# EAGLE schematic piboard (EAGLE 9.6.2)

## Sheet 1 of 5
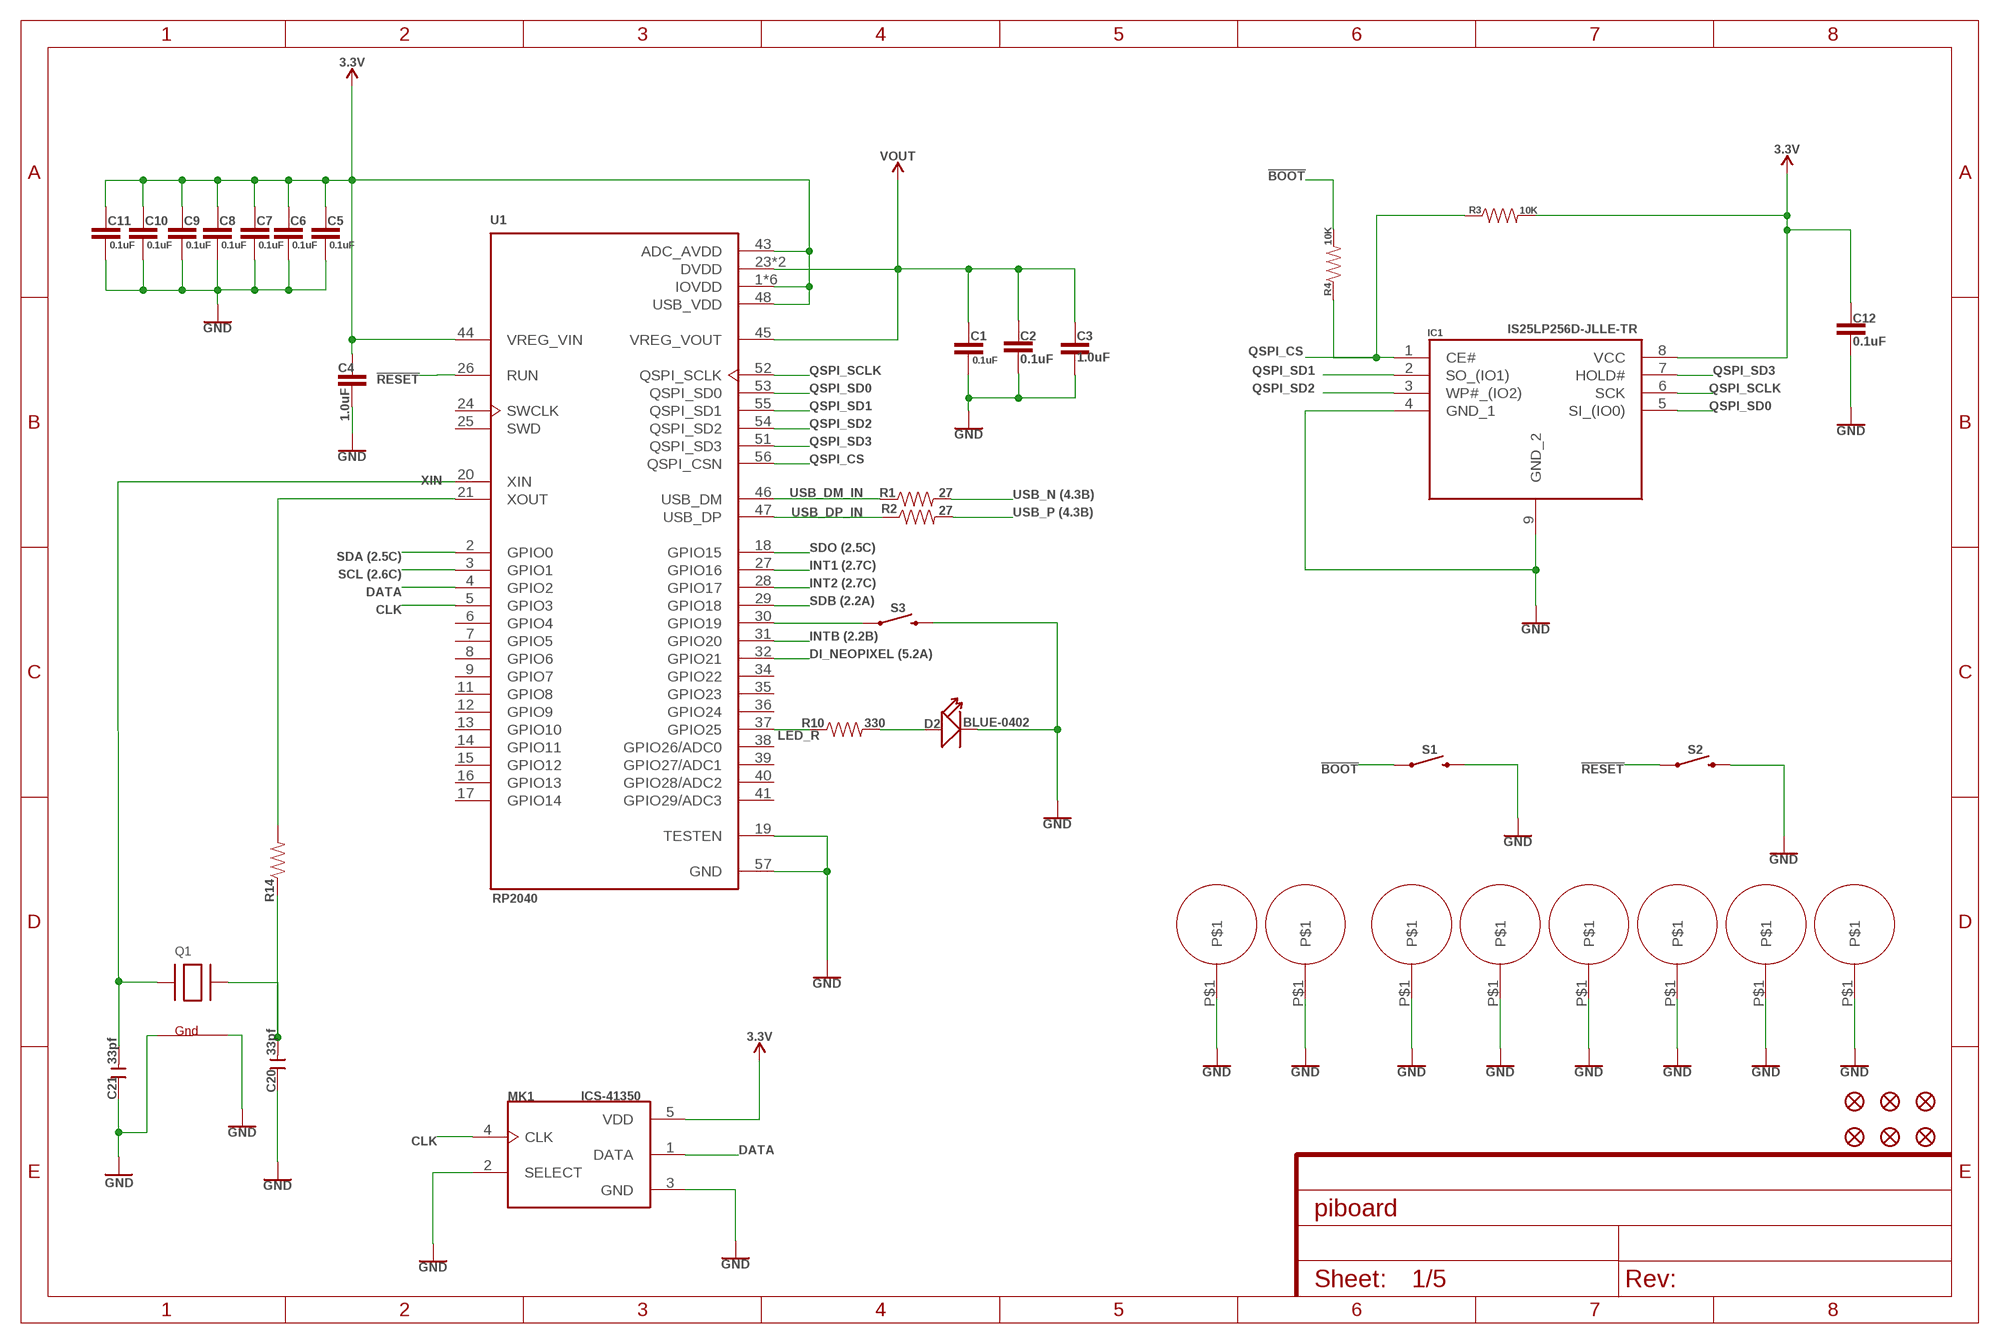
[diagram p0: schematic, sheet 1]

### Parts
C1  0.1uF  0.1UF-0402-16V-10%  [0402]
C2  0.1uF  0.1UF-0402-16V-10%  [0402]
C3  1.0uF  1.0UF-0402-16V-10%  [0402]
C4  1.0uF  1.0UF-0402-16V-10%  [0402]
C5  0.1uF  0.1UF-0402-16V-10%  [0402]
C6  0.1uF  0.1UF-0402-16V-10%  [0402]
C7  0.1uF  0.1UF-0402-16V-10%  [0402]
C8  0.1uF  0.1UF-0402-16V-10%  [0402]
C9  0.1uF  0.1UF-0402-16V-10%  [0402]
C10  0.1uF  0.1UF-0402-16V-10%  [0402]
C11  0.1uF  0.1UF-0402-16V-10%  [0402]
C12  0.1uF  0.1UF-0402-16V-10%  [0402]
C20  33pf  CERAMIC-33PF-50V-5%-NPO(0402)  [C0402]
C21  33pf  CERAMIC-33PF-50V-5%-NPO(0402)  [C0402]
D2  BLUE-0402  SMD-LED-CLEAR-BLUE(0402)  [LED-0402]
FD1  FIDUCIAL1X2  [FIDUCIAL-1X2]
FD2  FIDUCIAL1X2  [FIDUCIAL-1X2]
FD3  FIDUCIAL1X2  [FIDUCIAL-1X2]
FD4  FIDUCIAL1X2  [FIDUCIAL-1X2]
FD5  FIDUCIAL1X2  [FIDUCIAL-1X2]
FD6  FIDUCIAL1X2  [FIDUCIAL-1X2]
H1  M25  [M25]
H2  M25  [M25]
H3  M25  [M25]
H4  M25  [M25]
H5  M25  [M25]
H6  M25  [M25]
H7  M25  [M25]
H8  M25  [M25]
IC1  IS25LP256D-JLLE-TR  [SON127P800X600X80-9N]
MK1  ICS-41350  [MIC_ICS-41350]
Q1  XTAL-4-3225  [NX3225]
R1  27  RESISTOR0402  [0402]
R2  27  RESISTOR0402  [0402]
R3  10K  RESISTOR0402  [0402]
R4  10K  RESISTOR0402  [0402]
R10  330  RESISTOR0402  [0402]
R14  RESISTOR0402  [0402]
S1  MOMENTARY-SWITCH-SPST-SMD-4.6X2.8MM  [TACTILE_SWITCH_SMD_4.6X2.8MM]
S2  MOMENTARY-SWITCH-SPST-SMD-4.6X2.8MM  [TACTILE_SWITCH_SMD_4.6X2.8MM]
S3  MOMENTARY-SWITCH-SPST-SMD-4.6X2.8MM  [TACTILE_SWITCH_SMD_4.6X2.8MM]
U1  RP2040  [QFN40P700X700X90-57N]

### Nets
3.3V: C4.1 C5.1 C6.1 C7.1 C8.1 C9.1 C10.1 C11.1 C12.1 IC1.8(VCC) MK1.5(VDD) R3.2 U1.1(IOVDD) U1.10(IOVDD) U1.22(IOVDD) U1.33(IOVDD) U1.42(IOVDD) U1.43(ADC_AVDD) U1.44(VREG_VIN) U1.48(USB_VDD) U1.49(IOVDD) ; also sheet 2,4,5
!BOOT: R4.2 S1.1 S1.2
!RESET: S2.1 S2.2 U1.26(RUN)
CLK: MK1.4(CLK) U1.5(GPIO3)
DATA: MK1.1(DATA) U1.4(GPIO2)
DI_NEOPIXEL: U1.32(GPIO21) ; also sheet 5
GND: C1.2 C2.2 C3.2 C4.2 C5.2 C6.2 C7.2 C8.2 C9.2 C10.2 C11.2 C12.2 C20.1 C21.1 D2.- H1.P$1 H2.P$1 H3.P$1 H4.P$1 H5.P$1 H6.P$1 H7.P$1 H8.P$1 IC1.4(GND_1) IC1.9(GND_2) MK1.2(SELECT) MK1.3(GND) Q1.2(G2) Q1.4(G1) S1.3 S1.4 S2.3 S2.4 S3.3 S3.4 U1.19(TESTEN) U1.57(GND) ; also sheet 2,4,5
INT1: U1.27(GPIO16) ; also sheet 2
INT2: U1.28(GPIO17) ; also sheet 2
INTB: U1.31(GPIO20) ; also sheet 2
LED_R: R10.1 U1.37(GPIO25)
N$1: D2.+ R10.2
N$4: C20.2 Q1.3(X2) R14.1
N$6: R14.2 U1.21(XOUT)
N$9: S3.1 S3.2 U1.30(GPIO19)
QSPI_CS: IC1.1(CE#) R3.1 R4.1 U1.56(QSPI_CSN)
QSPI_SCLK: IC1.6(SCK) U1.52(QSPI_SCLK)
QSPI_SD0: IC1.5(SI_(IO0)) U1.53(QSPI_SD0)
QSPI_SD1: IC1.2(SO_(IO1)) U1.55(QSPI_SD1)
QSPI_SD2: IC1.3(WP#_(IO2)) U1.54(QSPI_SD2)
QSPI_SD3: IC1.7(HOLD#) U1.51(QSPI_SD3)
SCL: U1.3(GPIO1) ; also sheet 2
SDA: U1.2(GPIO0) ; also sheet 2
SDB: U1.29(GPIO18) ; also sheet 2
SDO: U1.18(GPIO15) ; also sheet 2
USB_DM_IN [USB]: R1.1 U1.46(USB_DM)
USB_DP_IN [USB]: R2.1 U1.47(USB_DP)
USB_N [USB]: R1.2 ; also sheet 4
USB_P [USB]: R2.2 ; also sheet 4
VOUT: C1.1 C2.1 C3.1 U1.23(DVDD) U1.45(VREG_VOUT) U1.50(DVDD)
XIN: C21.2 Q1.1(X1) U1.20(XIN)
Unconnected: U1.6(GPIO4) U1.7(GPIO5) U1.8(GPIO6) U1.9(GPIO7) U1.11(GPIO8) U1.12(GPIO9) U1.13(GPIO10) U1.14(GPIO11) U1.15(GPIO12) U1.16(GPIO13) U1.17(GPIO14) U1.24(SWCLK) U1.25(SWD) U1.34(GPIO22) U1.35(GPIO23) U1.36(GPIO24) U1.38(GPIO26/ADC0) U1.39(GPIO27/ADC1) U1.40(GPIO28/ADC2) U1.41(GPIO29/ADC3)

## Sheet 2 of 5
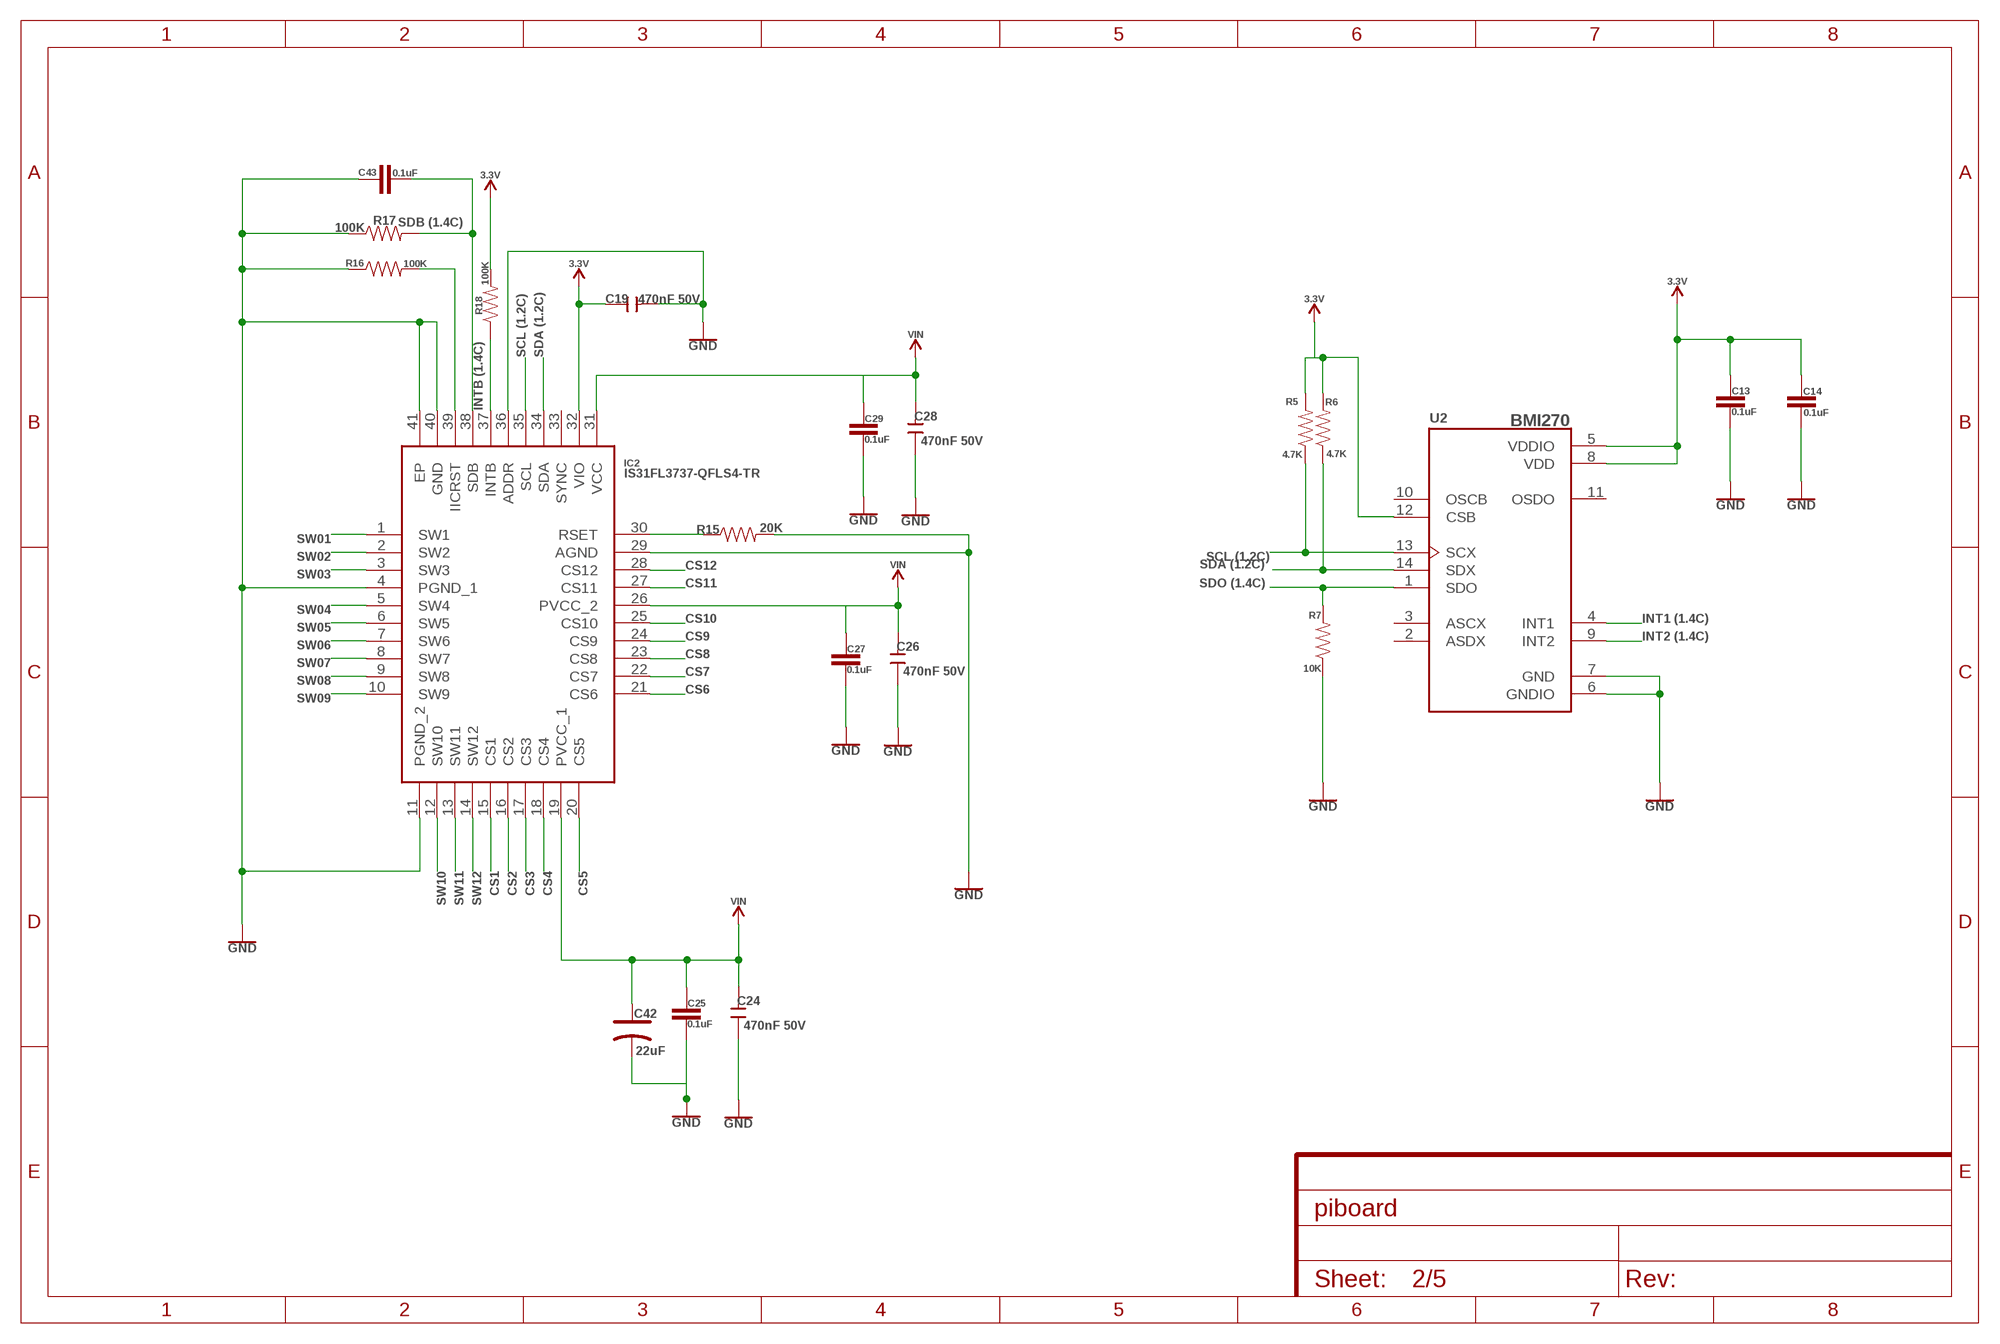
[diagram p1: schematic, sheet 2]

### Parts
C13  0.1uF  0.1UF-0402-16V-10%  [0402]
C14  0.1uF  0.1UF-0402-16V-10%  [0402]
C19  470nF 50V  CERAMIC-390PF-50V-10%-X7R(0402)  [C0402]
C24  470nF 50V  CERAMIC-390PF-50V-10%-X7R(0402)  [C0402]
C25  0.1uF  0.1UF-0402-16V-10%  [0402]
C26  470nF 50V  CERAMIC-390PF-50V-10%-X7R(0402)  [C0402]
C27  0.1uF  0.1UF-0402-16V-10%  [0402]
C28  470nF 50V  CERAMIC-390PF-50V-10%-X7R(0402)  [C0402]
C29  0.1uF  0.1UF-0402-16V-10%  [0402]
C42  22uF  TANTALUM-SMD-22UF-10V(AVX-A)  [AVX-A]
C43  0.1uF  0.1UF-0402-16V-10%  [0402]
IC2  IS31FL3737-QFLS4-TR  [QFN40P500X500X80-41N]
R5  4.7K  RESISTOR0402  [0402]
R6  4.7K  RESISTOR0402  [0402]
R7  10K  RESISTOR0402  [0402]
R15  20K  RESISTOR0402  [0402]
R16  100K  100KOHM-0402-1/16W-1%  [0402]
R17  100K  100KOHM-0402-1/16W-1%  [0402]
R18  100K  100KOHM-0402-1/16W-1%  [0402]
U2  BMI270  [XDCR_BMI270]

### Nets
3.3V: C13.1 C14.1 C19.1 IC2.32(VIO) R5.2 R6.2 R18.2 U2.5(VDDIO) U2.8(VDD) U2.12(CSB) ; also sheet 1,4,5
CS1: IC2.15(CS1) ; also sheet 3
CS2: IC2.16(CS2) ; also sheet 3
CS3: IC2.17(CS3) ; also sheet 3
CS4: IC2.18(CS4) ; also sheet 3
CS5: IC2.20(CS5) ; also sheet 3
CS6: IC2.21(CS6) ; also sheet 3
CS7: IC2.22(CS7) ; also sheet 3
CS8: IC2.23(CS8) ; also sheet 3
CS9: IC2.24(CS9) ; also sheet 3
CS10: IC2.25(CS10) ; also sheet 3
CS11: IC2.27(CS11) ; also sheet 3
CS12: IC2.28(CS12) ; also sheet 3
GND: C13.2 C14.2 C19.2 C24.1 C25.2 C26.1 C27.2 C28.1 C29.2 C42.- C43.1 IC2.4(PGND_1) IC2.11(PGND_2) IC2.29(AGND) IC2.36(ADDR) IC2.40(GND) IC2.41(EP) R7.1 R15.2 R16.1 R17.1 U2.6(GNDIO) U2.7(GND) ; also sheet 1,4,5
INT1: U2.4(INT1) ; also sheet 1
INT2: U2.9(INT2) ; also sheet 1
INTB: IC2.37(INTB) R18.1 ; also sheet 1
N$10: IC2.30(RSET) R15.1
N$18: IC2.39(IICRST) R16.2
SCL: IC2.35(SCL) R5.1 U2.13(SCX) ; also sheet 1
SDA: IC2.34(SDA) R6.1 U2.14(SDX) ; also sheet 1
SDB: C43.2 IC2.38(SDB) R17.2 ; also sheet 1
SDO: R7.2 U2.1(SDO) ; also sheet 1
SW01: IC2.1(SW1) ; also sheet 3
SW02: IC2.2(SW2) ; also sheet 3
SW03: IC2.3(SW3) ; also sheet 3
SW04: IC2.5(SW4) ; also sheet 3
SW05: IC2.6(SW5) ; also sheet 3
SW06: IC2.7(SW6) ; also sheet 3
SW07: IC2.8(SW7) ; also sheet 3
SW08: IC2.9(SW8) ; also sheet 3
SW09: IC2.10(SW9) ; also sheet 3
SW10: IC2.12(SW10) ; also sheet 3
SW11: IC2.13(SW11) ; also sheet 3
SW12: IC2.14(SW12) ; also sheet 3
VIN: C24.2 C25.1 C26.2 C27.1 C28.2 C29.1 C42.+ IC2.19(PVCC_1) IC2.26(PVCC_2) IC2.31(VCC) ; also sheet 4
Unconnected: IC2.33(SYNC) U2.2(ASDX) U2.3(ASCX) U2.10(OSCB) U2.11(OSDO)

## Sheet 3 of 5
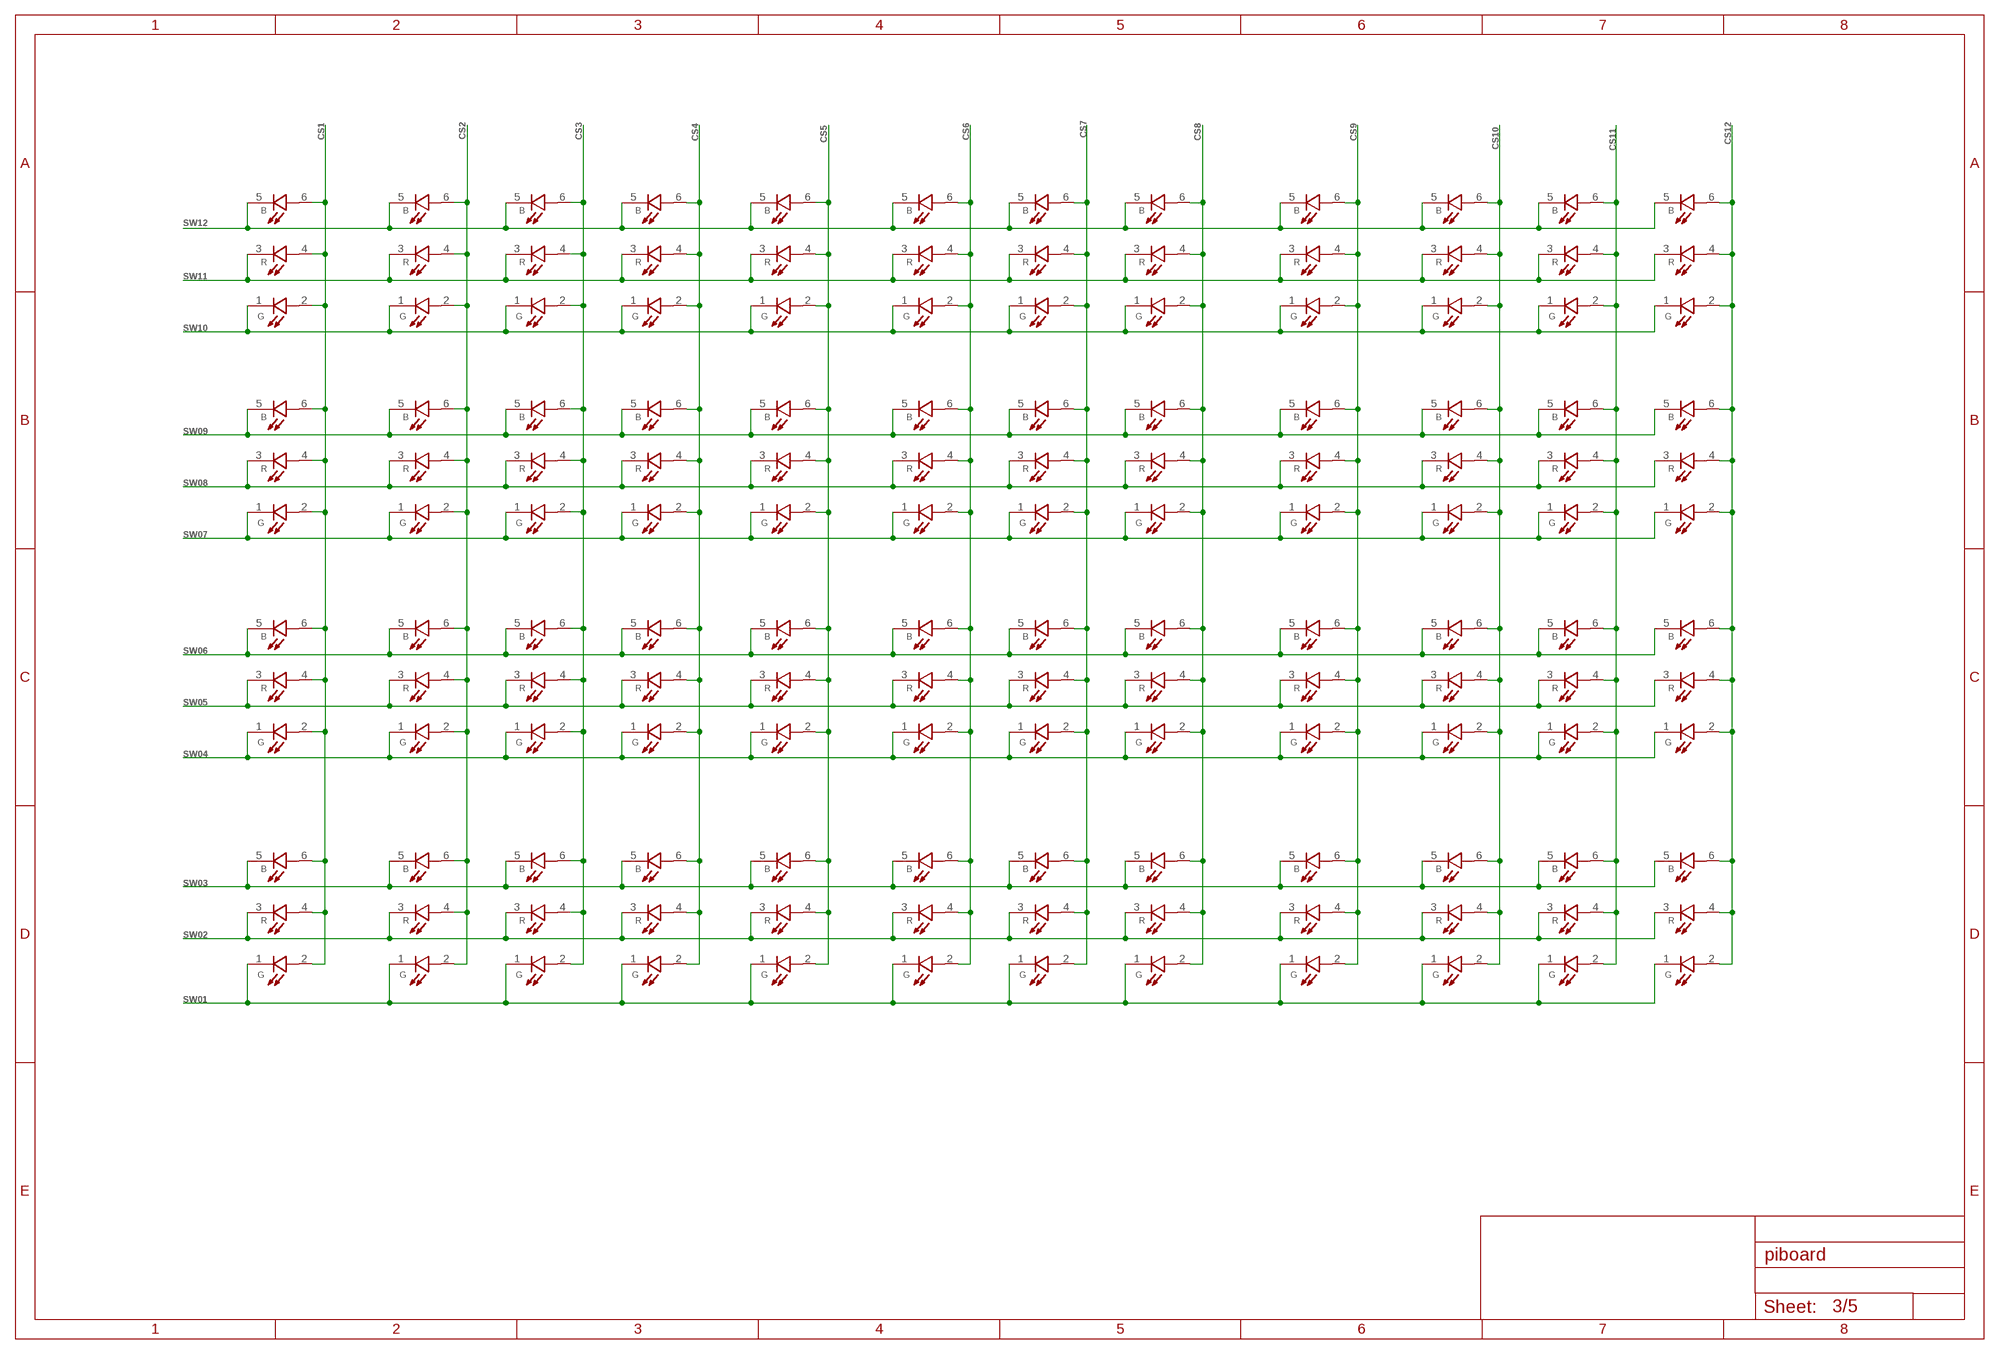
[diagram p2: schematic, sheet 3]

### Parts
RGB1  19-337C/RSBHGHC-A88/4T  [LED_19-337C/RSBHGHC-A88/4T]
RGB2  19-337C/RSBHGHC-A88/4T  [LED_19-337C/RSBHGHC-A88/4T]
RGB3  19-337C/RSBHGHC-A88/4T  [LED_19-337C/RSBHGHC-A88/4T]
RGB4  19-337C/RSBHGHC-A88/4T  [LED_19-337C/RSBHGHC-A88/4T]
RGB5  19-337C/RSBHGHC-A88/4T  [LED_19-337C/RSBHGHC-A88/4T]
RGB6  19-337C/RSBHGHC-A88/4T  [LED_19-337C/RSBHGHC-A88/4T]
RGB7  19-337C/RSBHGHC-A88/4T  [LED_19-337C/RSBHGHC-A88/4T]
RGB8  19-337C/RSBHGHC-A88/4T  [LED_19-337C/RSBHGHC-A88/4T]
RGB9  19-337C/RSBHGHC-A88/4T  [LED_19-337C/RSBHGHC-A88/4T]
RGB10  19-337C/RSBHGHC-A88/4T  [LED_19-337C/RSBHGHC-A88/4T]
RGB11  19-337C/RSBHGHC-A88/4T  [LED_19-337C/RSBHGHC-A88/4T]
RGB12  19-337C/RSBHGHC-A88/4T  [LED_19-337C/RSBHGHC-A88/4T]
RGB13  19-337C/RSBHGHC-A88/4T  [LED_19-337C/RSBHGHC-A88/4T]
RGB14  19-337C/RSBHGHC-A88/4T  [LED_19-337C/RSBHGHC-A88/4T]
RGB15  19-337C/RSBHGHC-A88/4T  [LED_19-337C/RSBHGHC-A88/4T]
RGB16  19-337C/RSBHGHC-A88/4T  [LED_19-337C/RSBHGHC-A88/4T]
RGB17  19-337C/RSBHGHC-A88/4T  [LED_19-337C/RSBHGHC-A88/4T]
RGB18  19-337C/RSBHGHC-A88/4T  [LED_19-337C/RSBHGHC-A88/4T]
RGB19  19-337C/RSBHGHC-A88/4T  [LED_19-337C/RSBHGHC-A88/4T]
RGB20  19-337C/RSBHGHC-A88/4T  [LED_19-337C/RSBHGHC-A88/4T]
RGB21  19-337C/RSBHGHC-A88/4T  [LED_19-337C/RSBHGHC-A88/4T]
RGB22  19-337C/RSBHGHC-A88/4T  [LED_19-337C/RSBHGHC-A88/4T]
RGB23  19-337C/RSBHGHC-A88/4T  [LED_19-337C/RSBHGHC-A88/4T]
RGB24  19-337C/RSBHGHC-A88/4T  [LED_19-337C/RSBHGHC-A88/4T]
RGB25  19-337C/RSBHGHC-A88/4T  [LED_19-337C/RSBHGHC-A88/4T]
RGB26  19-337C/RSBHGHC-A88/4T  [LED_19-337C/RSBHGHC-A88/4T]
RGB27  19-337C/RSBHGHC-A88/4T  [LED_19-337C/RSBHGHC-A88/4T]
RGB28  19-337C/RSBHGHC-A88/4T  [LED_19-337C/RSBHGHC-A88/4T]
RGB29  19-337C/RSBHGHC-A88/4T  [LED_19-337C/RSBHGHC-A88/4T]
RGB30  19-337C/RSBHGHC-A88/4T  [LED_19-337C/RSBHGHC-A88/4T]
RGB31  19-337C/RSBHGHC-A88/4T  [LED_19-337C/RSBHGHC-A88/4T]
RGB32  19-337C/RSBHGHC-A88/4T  [LED_19-337C/RSBHGHC-A88/4T]
RGB33  19-337C/RSBHGHC-A88/4T  [LED_19-337C/RSBHGHC-A88/4T]
RGB34  19-337C/RSBHGHC-A88/4T  [LED_19-337C/RSBHGHC-A88/4T]
RGB35  19-337C/RSBHGHC-A88/4T  [LED_19-337C/RSBHGHC-A88/4T]
RGB36  19-337C/RSBHGHC-A88/4T  [LED_19-337C/RSBHGHC-A88/4T]
RGB37  19-337C/RSBHGHC-A88/4T  [LED_19-337C/RSBHGHC-A88/4T]
RGB38  19-337C/RSBHGHC-A88/4T  [LED_19-337C/RSBHGHC-A88/4T]
RGB39  19-337C/RSBHGHC-A88/4T  [LED_19-337C/RSBHGHC-A88/4T]
RGB40  19-337C/RSBHGHC-A88/4T  [LED_19-337C/RSBHGHC-A88/4T]
RGB41  19-337C/RSBHGHC-A88/4T  [LED_19-337C/RSBHGHC-A88/4T]
RGB42  19-337C/RSBHGHC-A88/4T  [LED_19-337C/RSBHGHC-A88/4T]
RGB43  19-337C/RSBHGHC-A88/4T  [LED_19-337C/RSBHGHC-A88/4T]
RGB44  19-337C/RSBHGHC-A88/4T  [LED_19-337C/RSBHGHC-A88/4T]
RGB45  19-337C/RSBHGHC-A88/4T  [LED_19-337C/RSBHGHC-A88/4T]
RGB46  19-337C/RSBHGHC-A88/4T  [LED_19-337C/RSBHGHC-A88/4T]
RGB47  19-337C/RSBHGHC-A88/4T  [LED_19-337C/RSBHGHC-A88/4T]
RGB48  19-337C/RSBHGHC-A88/4T  [LED_19-337C/RSBHGHC-A88/4T]

### Nets
CS1: RGB1.2(G_A) RGB1.4(R_A) RGB1.6(B_A) RGB13.2(G_A) RGB13.4(R_A) RGB13.6(B_A) RGB25.2(G_A) RGB25.4(R_A) RGB25.6(B_A) RGB37.2(G_A) RGB37.4(R_A) RGB37.6(B_A) ; also sheet 2
CS2: RGB2.2(G_A) RGB2.4(R_A) RGB2.6(B_A) RGB14.2(G_A) RGB14.4(R_A) RGB14.6(B_A) RGB26.2(G_A) RGB26.4(R_A) RGB26.6(B_A) RGB38.2(G_A) RGB38.4(R_A) RGB38.6(B_A) ; also sheet 2
CS3: RGB3.2(G_A) RGB3.4(R_A) RGB3.6(B_A) RGB15.2(G_A) RGB15.4(R_A) RGB15.6(B_A) RGB27.2(G_A) RGB27.4(R_A) RGB27.6(B_A) RGB39.2(G_A) RGB39.4(R_A) RGB39.6(B_A) ; also sheet 2
CS4: RGB4.2(G_A) RGB4.4(R_A) RGB4.6(B_A) RGB16.2(G_A) RGB16.4(R_A) RGB16.6(B_A) RGB28.2(G_A) RGB28.4(R_A) RGB28.6(B_A) RGB40.2(G_A) RGB40.4(R_A) RGB40.6(B_A) ; also sheet 2
CS5: RGB5.2(G_A) RGB5.4(R_A) RGB5.6(B_A) RGB17.2(G_A) RGB17.4(R_A) RGB17.6(B_A) RGB29.2(G_A) RGB29.4(R_A) RGB29.6(B_A) RGB41.2(G_A) RGB41.4(R_A) RGB41.6(B_A) ; also sheet 2
CS6: RGB6.2(G_A) RGB6.4(R_A) RGB6.6(B_A) RGB18.2(G_A) RGB18.4(R_A) RGB18.6(B_A) RGB30.2(G_A) RGB30.4(R_A) RGB30.6(B_A) RGB42.2(G_A) RGB42.4(R_A) RGB42.6(B_A) ; also sheet 2
CS7: RGB7.2(G_A) RGB7.4(R_A) RGB7.6(B_A) RGB19.2(G_A) RGB19.4(R_A) RGB19.6(B_A) RGB31.2(G_A) RGB31.4(R_A) RGB31.6(B_A) RGB43.2(G_A) RGB43.4(R_A) RGB43.6(B_A) ; also sheet 2
CS8: RGB8.2(G_A) RGB8.4(R_A) RGB8.6(B_A) RGB20.2(G_A) RGB20.4(R_A) RGB20.6(B_A) RGB32.2(G_A) RGB32.4(R_A) RGB32.6(B_A) RGB44.2(G_A) RGB44.4(R_A) RGB44.6(B_A) ; also sheet 2
CS9: RGB9.2(G_A) RGB9.4(R_A) RGB9.6(B_A) RGB21.2(G_A) RGB21.4(R_A) RGB21.6(B_A) RGB33.2(G_A) RGB33.4(R_A) RGB33.6(B_A) RGB45.2(G_A) RGB45.4(R_A) RGB45.6(B_A) ; also sheet 2
CS10: RGB10.2(G_A) RGB10.4(R_A) RGB10.6(B_A) RGB22.2(G_A) RGB22.4(R_A) RGB22.6(B_A) RGB34.2(G_A) RGB34.4(R_A) RGB34.6(B_A) RGB46.2(G_A) RGB46.4(R_A) RGB46.6(B_A) ; also sheet 2
CS11: RGB11.2(G_A) RGB11.4(R_A) RGB11.6(B_A) RGB23.2(G_A) RGB23.4(R_A) RGB23.6(B_A) RGB35.2(G_A) RGB35.4(R_A) RGB35.6(B_A) RGB47.2(G_A) RGB47.4(R_A) RGB47.6(B_A) ; also sheet 2
CS12: RGB12.2(G_A) RGB12.4(R_A) RGB12.6(B_A) RGB24.2(G_A) RGB24.4(R_A) RGB24.6(B_A) RGB36.2(G_A) RGB36.4(R_A) RGB36.6(B_A) RGB48.2(G_A) RGB48.4(R_A) RGB48.6(B_A) ; also sheet 2
SW01: RGB37.1(G_C) RGB38.1(G_C) RGB39.1(G_C) RGB40.1(G_C) RGB41.1(G_C) RGB42.1(G_C) RGB43.1(G_C) RGB44.1(G_C) RGB45.1(G_C) RGB46.1(G_C) RGB47.1(G_C) RGB48.1(G_C) ; also sheet 2
SW02: RGB37.3(R_C) RGB38.3(R_C) RGB39.3(R_C) RGB40.3(R_C) RGB41.3(R_C) RGB42.3(R_C) RGB43.3(R_C) RGB44.3(R_C) RGB45.3(R_C) RGB46.3(R_C) RGB47.3(R_C) RGB48.3(R_C) ; also sheet 2
SW03: RGB37.5(B_C) RGB38.5(B_C) RGB39.5(B_C) RGB40.5(B_C) RGB41.5(B_C) RGB42.5(B_C) RGB43.5(B_C) RGB44.5(B_C) RGB45.5(B_C) RGB46.5(B_C) RGB47.5(B_C) RGB48.5(B_C) ; also sheet 2
SW04: RGB25.1(G_C) RGB26.1(G_C) RGB27.1(G_C) RGB28.1(G_C) RGB29.1(G_C) RGB30.1(G_C) RGB31.1(G_C) RGB32.1(G_C) RGB33.1(G_C) RGB34.1(G_C) RGB35.1(G_C) RGB36.1(G_C) ; also sheet 2
SW05: RGB25.3(R_C) RGB26.3(R_C) RGB27.3(R_C) RGB28.3(R_C) RGB29.3(R_C) RGB30.3(R_C) RGB31.3(R_C) RGB32.3(R_C) RGB33.3(R_C) RGB34.3(R_C) RGB35.3(R_C) RGB36.3(R_C) ; also sheet 2
SW06: RGB25.5(B_C) RGB26.5(B_C) RGB27.5(B_C) RGB28.5(B_C) RGB29.5(B_C) RGB30.5(B_C) RGB31.5(B_C) RGB32.5(B_C) RGB33.5(B_C) RGB34.5(B_C) RGB35.5(B_C) RGB36.5(B_C) ; also sheet 2
SW07: RGB13.1(G_C) RGB14.1(G_C) RGB15.1(G_C) RGB16.1(G_C) RGB17.1(G_C) RGB18.1(G_C) RGB19.1(G_C) RGB20.1(G_C) RGB21.1(G_C) RGB22.1(G_C) RGB23.1(G_C) RGB24.1(G_C) ; also sheet 2
SW08: RGB13.3(R_C) RGB14.3(R_C) RGB15.3(R_C) RGB16.3(R_C) RGB17.3(R_C) RGB18.3(R_C) RGB19.3(R_C) RGB20.3(R_C) RGB21.3(R_C) RGB22.3(R_C) RGB23.3(R_C) RGB24.3(R_C) ; also sheet 2
SW09: RGB13.5(B_C) RGB14.5(B_C) RGB15.5(B_C) RGB16.5(B_C) RGB17.5(B_C) RGB18.5(B_C) RGB19.5(B_C) RGB20.5(B_C) RGB21.5(B_C) RGB22.5(B_C) RGB23.5(B_C) RGB24.5(B_C) ; also sheet 2
SW10: RGB1.1(G_C) RGB2.1(G_C) RGB3.1(G_C) RGB4.1(G_C) RGB5.1(G_C) RGB6.1(G_C) RGB7.1(G_C) RGB8.1(G_C) RGB9.1(G_C) RGB10.1(G_C) RGB11.1(G_C) RGB12.1(G_C) ; also sheet 2
SW11: RGB1.3(R_C) RGB2.3(R_C) RGB3.3(R_C) RGB4.3(R_C) RGB5.3(R_C) RGB6.3(R_C) RGB7.3(R_C) RGB8.3(R_C) RGB9.3(R_C) RGB10.3(R_C) RGB11.3(R_C) RGB12.3(R_C) ; also sheet 2
SW12: RGB1.5(B_C) RGB2.5(B_C) RGB3.5(B_C) RGB4.5(B_C) RGB5.5(B_C) RGB6.5(B_C) RGB7.5(B_C) RGB8.5(B_C) RGB9.5(B_C) RGB10.5(B_C) RGB11.5(B_C) RGB12.5(B_C) ; also sheet 2

## Sheet 4 of 5
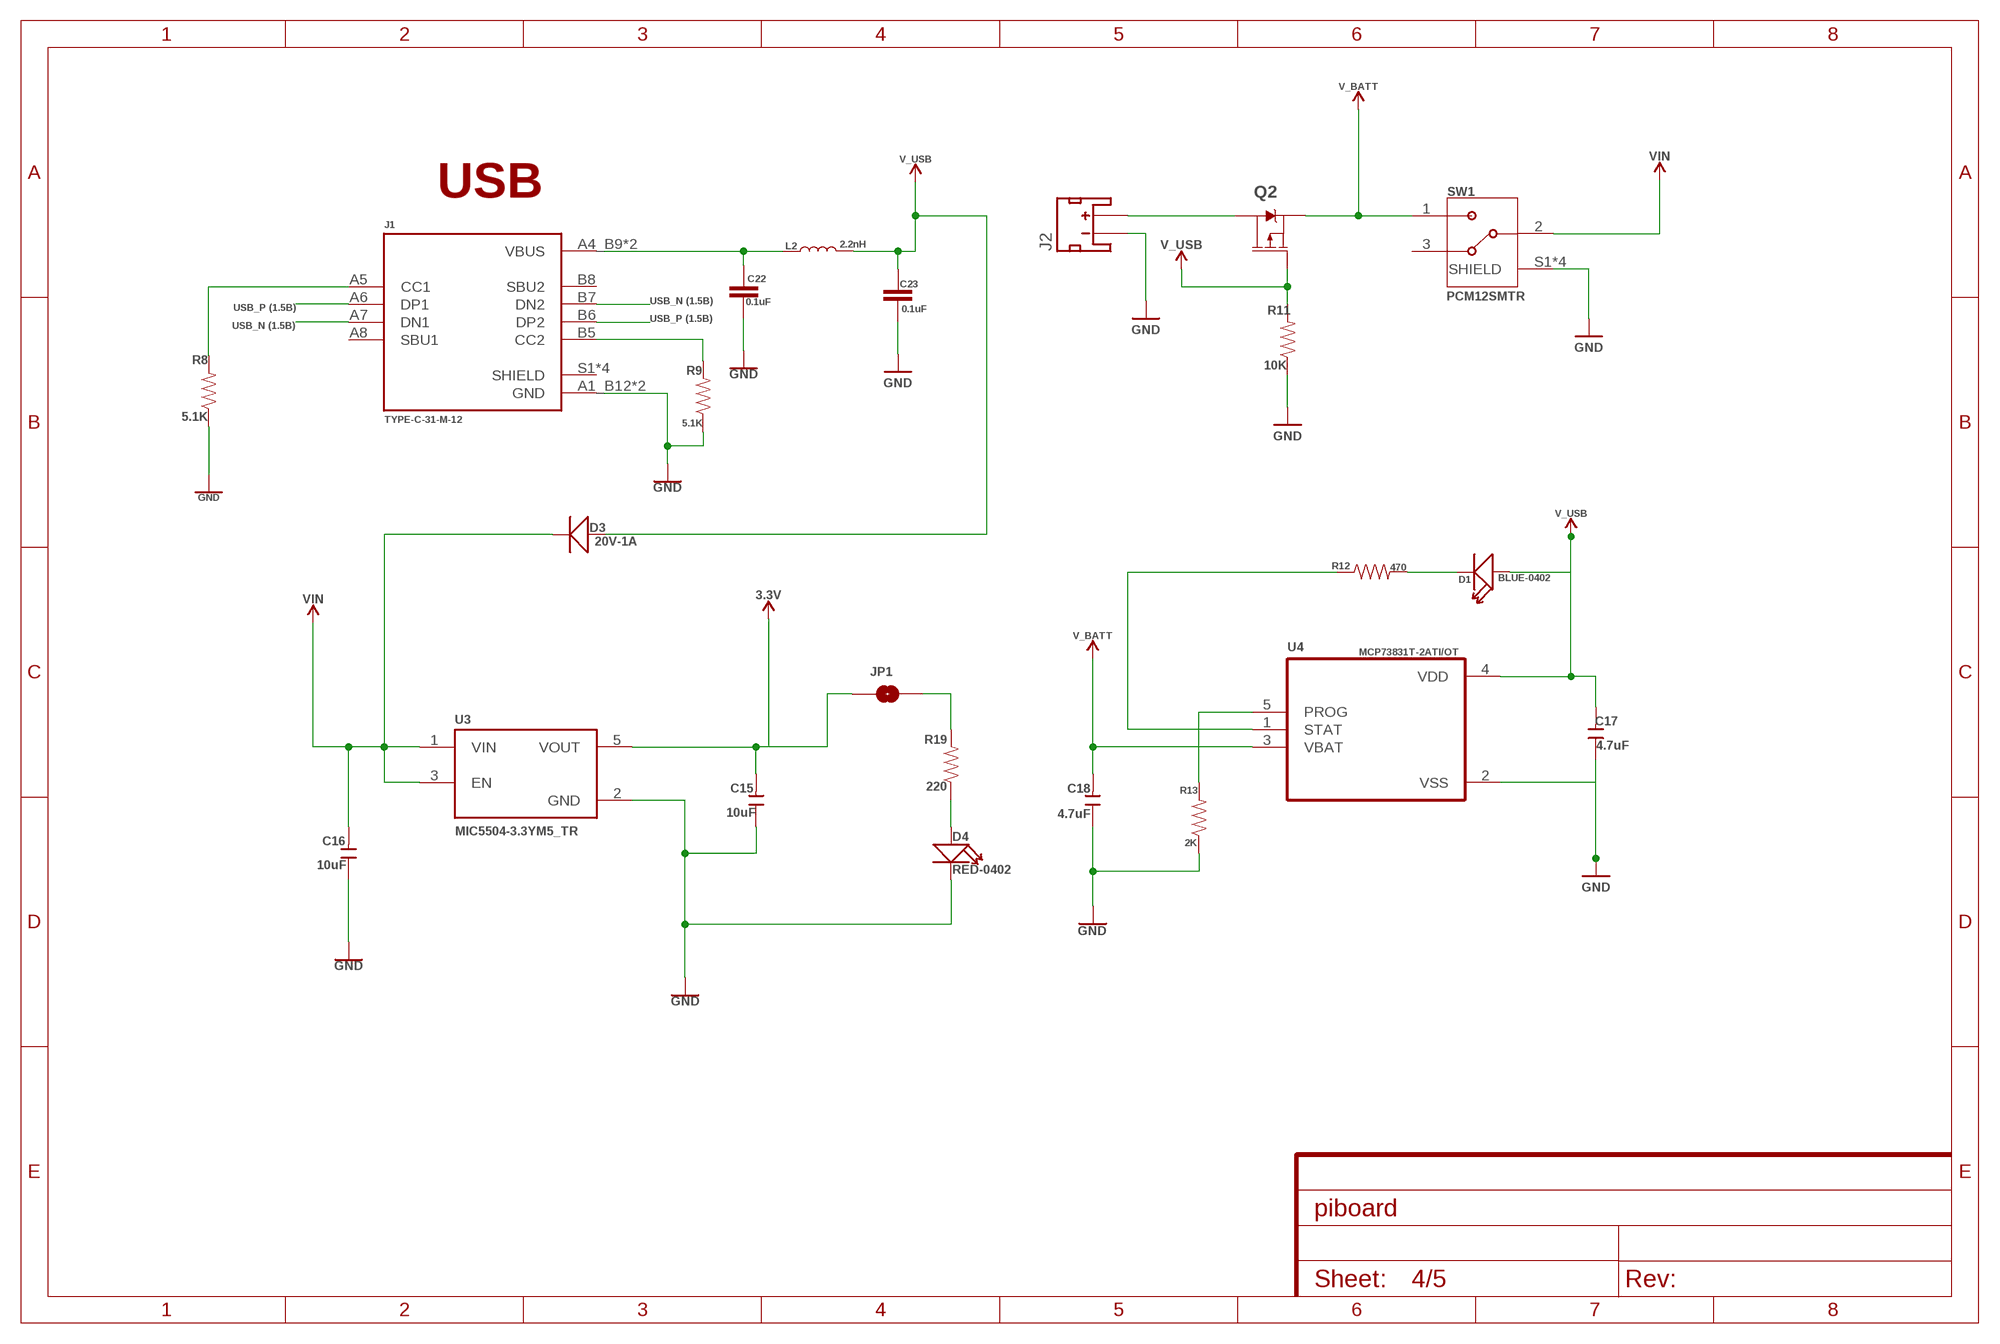
[diagram p3: schematic, sheet 4]

### Parts
C15  10uF  CERAMIC-10UF-6.3V-20%-X5R(0402)  [C0402]
C16  10uF  CERAMIC-10UF-6.3V-20%-X5R(0402)  [C0402]
C17  4.7uF  CERAMIC-4.7UF-6.3V-20%-X5R(0402)  [C0402]
C18  4.7uF  CERAMIC-4.7UF-6.3V-20%-X5R(0402)  [C0402]
C22  0.1uF  0.1UF-0402-16V-10%  [0402]
C23  0.1uF  0.1UF-0402-16V-10%  [0402]
D1  BLUE-0402  SMD-LED-CLEAR-BLUE(0402)  [LED-0402]
D3  20V-1A  SMD-DIODE-SCHOTTKY-20V-1A(SOD-123)  [SOD-123]
D4  RED-0402  SMD-LED-CLEAR-BLUE(0402)  [LED-0402]
J1  TYPE-C-31-M-12  [HRO_TYPE-C-31-M-12]
J2  JST_2MM_MALE  [JST-2-SMD]
JP1  JUMPER-SMT_2_NO_SILK_ROUND  [SMT-JUMPER_2_NO_SILK_ROUND]
L2  2.2nH  INDUCTOR-0402-3.9NH  [0402]
Q2  2.5A/30V/105mΩ  MOSFET_PCH-DMG2307L  [SOT23-3]
R8  5.1K  RESISTOR0402  [0402]
R9  5.1K  RESISTOR0402  [0402]
R11  10K  RESISTOR0402  [0402]
R12  470  RESISTOR0402  [0402]
R13  2K  RESISTOR0402  [0402]
R19  220  RESISTOR0402  [0402]
SW1  PCM12SMTR  [SW_PCM12SMTR]
U3  MIC5504-3.3YM5_TR  [SOT95P280X145-5N]
U4  MCP73831T-2ATI/OT  [SOT95P280X145-5N]

### Nets
3.3V: C15.2 JP1.1 U3.5(VOUT) ; also sheet 1,2,5
GND: C15.1 C16.1 C17.1 C18.1 C22.2 C23.2 D4.- J1.A1_B12(GND) J1.B1_A12(GND) J2.1(-) R8.1 R9.1 R11.1 R13.1 SW1.S1(SHIELD) SW1.S2(SHIELD) SW1.S3(SHIELD) SW1.S4(SHIELD) U3.2(GND) U4.2(VSS) ; also sheet 1,2,5
N$5: J1.A5(CC1) R8.2
N$8: J1.B5(CC2) R9.2
N$11: J2.2(+) Q2.3(D)
N$12: D1.- R12.2
N$13: R12.1 U4.1(STAT)
N$14: C22.1 J1.A4_B9(VBUS) J1.B4_A9(VBUS) L2.1
N$15: R13.2 U4.5(PROG)
N$16: D4.+ R19.1
N$17: JP1.2 R19.2
USB_N [USB]: J1.A7(DN1) J1.B7(DN2) ; also sheet 1
USB_P [USB]: J1.A6(DP1) J1.B6(DP2) ; also sheet 1
V_BATT: C18.2 Q2.2(S) SW1.1 U4.3(VBAT)
V_USB: C17.2 C23.1 D1.+ D3.+ L2.2 Q2.1(G) R11.2 U4.4(VDD)
VIN: C16.2 D3.- SW1.2 U3.1(VIN) U3.3(EN) ; also sheet 2
Unconnected: J1.A8(SBU1) J1.B8(SBU2) J1.S1(SHIELD) J1.S2(SHIELD) J1.S3(SHIELD) J1.S4(SHIELD) J2.NC1(PAD1) J2.NC2(PAD2) SW1.3

### Notes on the sheet
- USB

## Sheet 5 of 5
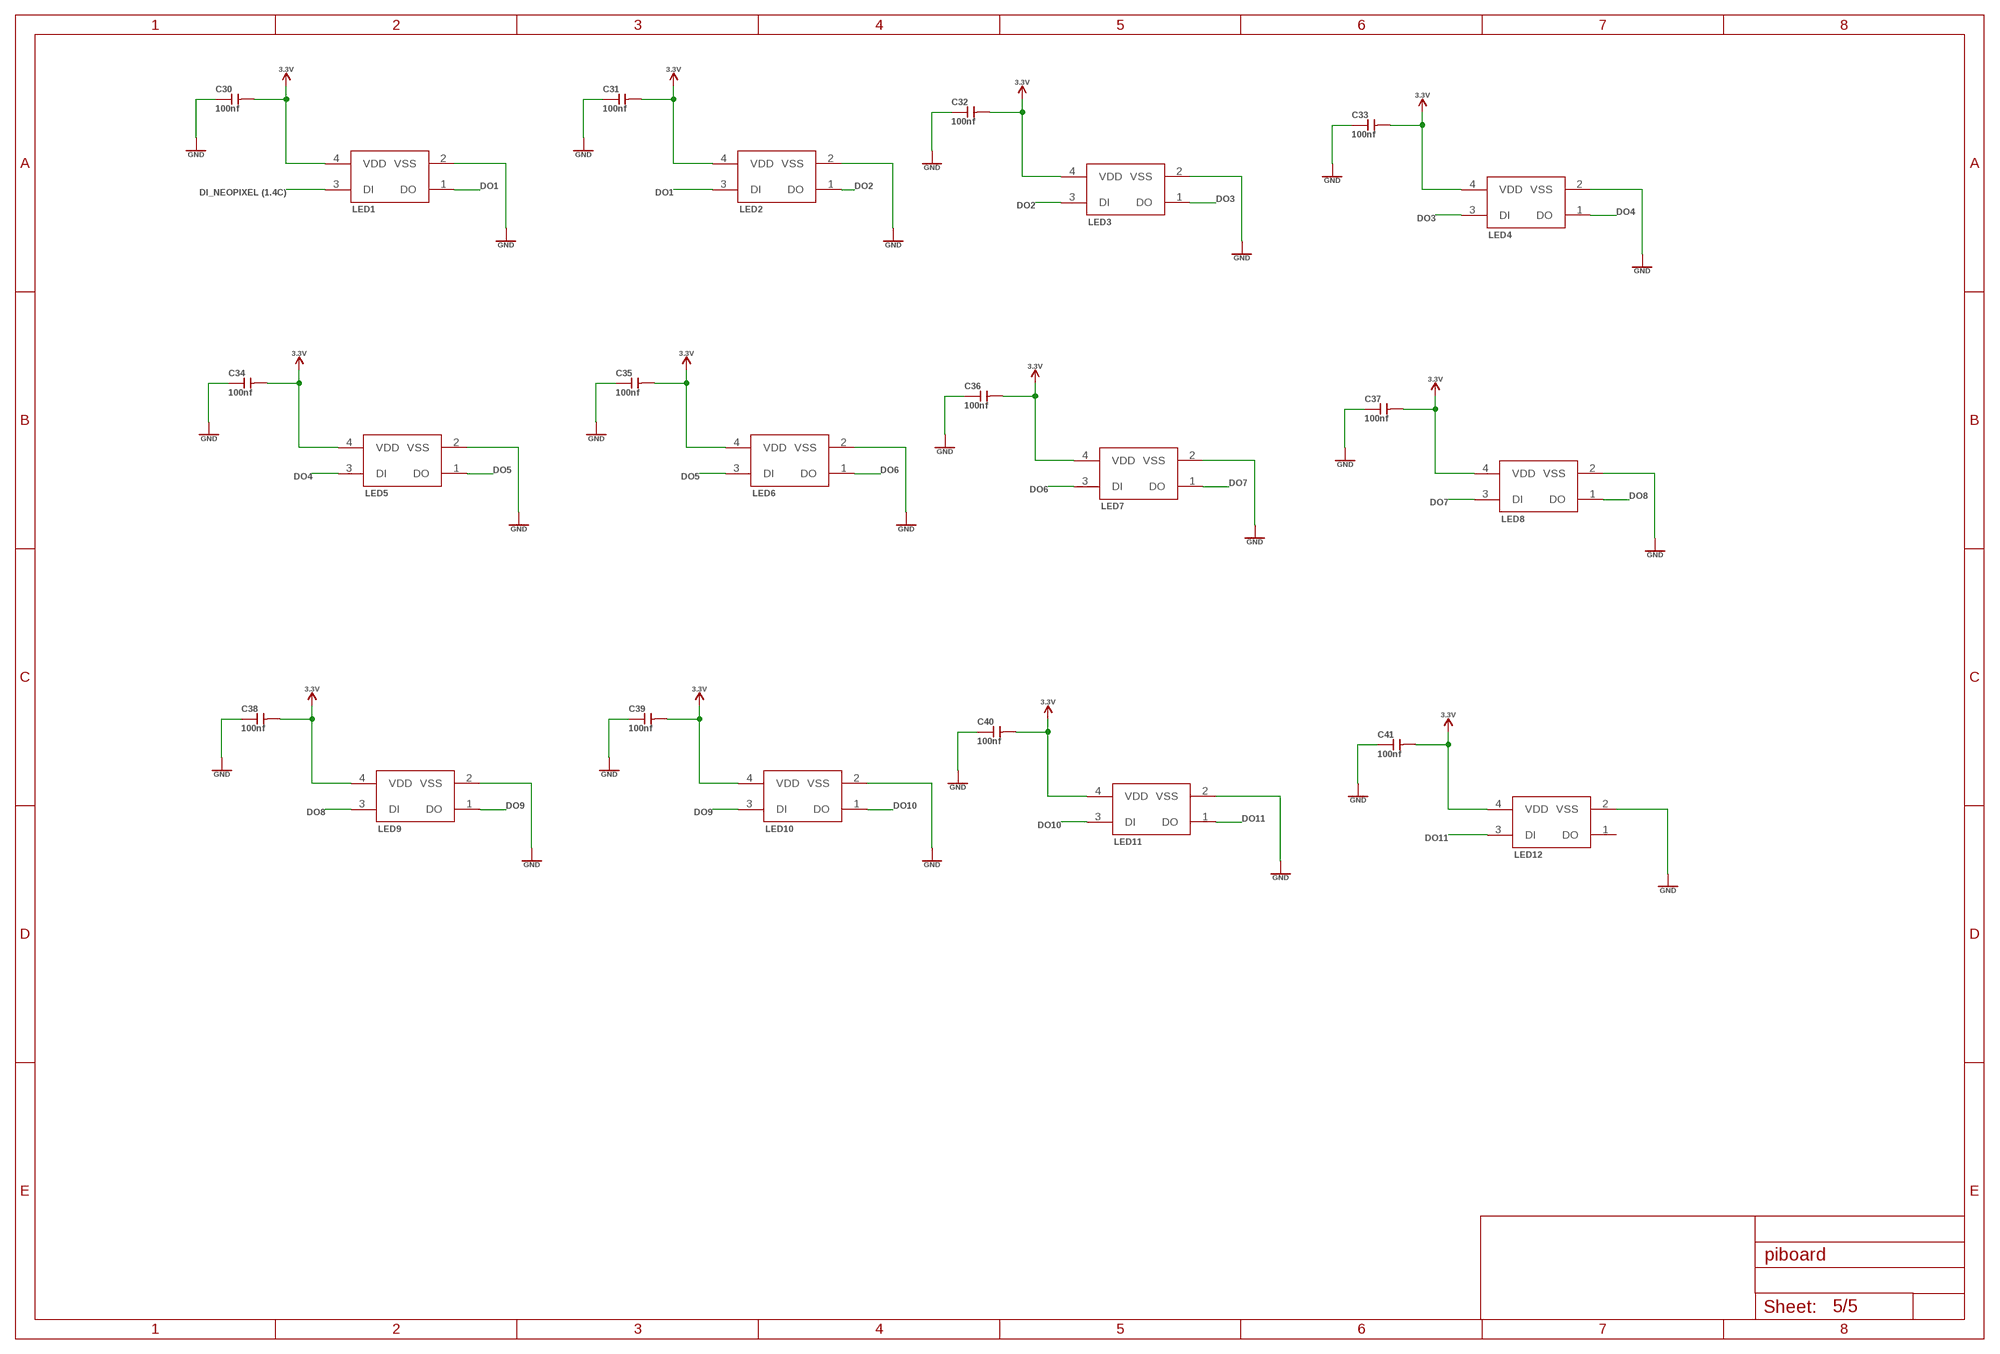
[diagram p4: schematic, sheet 5]

### Parts
C30  100nf  CERAMIC-100NF-25V-10%-X7R(0402)  [C0402]
C31  100nf  CERAMIC-100NF-25V-10%-X7R(0402)  [C0402]
C32  100nf  CERAMIC-100NF-25V-10%-X7R(0402)  [C0402]
C33  100nf  CERAMIC-100NF-25V-10%-X7R(0402)  [C0402]
C34  100nf  CERAMIC-100NF-25V-10%-X7R(0402)  [C0402]
C35  100nf  CERAMIC-100NF-25V-10%-X7R(0402)  [C0402]
C36  100nf  CERAMIC-100NF-25V-10%-X7R(0402)  [C0402]
C37  100nf  CERAMIC-100NF-25V-10%-X7R(0402)  [C0402]
C38  100nf  CERAMIC-100NF-25V-10%-X7R(0402)  [C0402]
C39  100nf  CERAMIC-100NF-25V-10%-X7R(0402)  [C0402]
C40  100nf  CERAMIC-100NF-25V-10%-X7R(0402)  [C0402]
C41  100nf  CERAMIC-100NF-25V-10%-X7R(0402)  [C0402]
LED1  WS2812B-2020  [WS2812B-2020]
LED2  WS2812B-2020  [WS2812B-2020]
LED3  WS2812B-2020  [WS2812B-2020]
LED4  WS2812B-2020  [WS2812B-2020]
LED5  WS2812B-2020  [WS2812B-2020]
LED6  WS2812B-2020  [WS2812B-2020]
LED7  WS2812B-2020  [WS2812B-2020]
LED8  WS2812B-2020  [WS2812B-2020]
LED9  WS2812B-2020  [WS2812B-2020]
LED10  WS2812B-2020  [WS2812B-2020]
LED11  WS2812B-2020  [WS2812B-2020]
LED12  WS2812B-2020  [WS2812B-2020]

### Nets
3.3V: C30.2 C31.2 C32.2 C33.2 C34.2 C35.2 C36.2 C37.2 C38.2 C39.2 C40.2 C41.2 LED1.4(VDD) LED2.4(VDD) LED3.4(VDD) LED4.4(VDD) LED5.4(VDD) LED6.4(VDD) LED7.4(VDD) LED8.4(VDD) LED9.4(VDD) LED10.4(VDD) LED11.4(VDD) LED12.4(VDD) ; also sheet 1,2,4
DI_NEOPIXEL: LED1.3(DI) ; also sheet 1
DO1: LED1.1(DO) LED2.3(DI)
DO2: LED2.1(DO) LED3.3(DI)
DO3: LED3.1(DO) LED4.3(DI)
DO4: LED4.1(DO) LED5.3(DI)
DO5: LED5.1(DO) LED6.3(DI)
DO6: LED6.1(DO) LED7.3(DI)
DO7: LED7.1(DO) LED8.3(DI)
DO8: LED8.1(DO) LED9.3(DI)
DO9: LED9.1(DO) LED10.3(DI)
DO10: LED10.1(DO) LED11.3(DI)
DO11: LED11.1(DO) LED12.3(DI)
GND: C30.1 C31.1 C32.1 C33.1 C34.1 C35.1 C36.1 C37.1 C38.1 C39.1 C40.1 C41.1 LED1.2(VSS) LED2.2(VSS) LED3.2(VSS) LED4.2(VSS) LED5.2(VSS) LED6.2(VSS) LED7.2(VSS) LED8.2(VSS) LED9.2(VSS) LED10.2(VSS) LED11.2(VSS) LED12.2(VSS) ; also sheet 1,2,4
Unconnected: LED12.1(DO)

## Library data of the parts
C1 C2 C5-C14 C22 C23 C25 C27 C29 C43 = SparkFun-Capacitors:0.1UF: 0.1µF ceramic capacitors A capacitor is a passive two-terminal electrical component used to store electrical energy temporarily in an electric field.; PROD_ID: CAP-12416
C3 C4 = SparkFun-Capacitors:1.0UF: 1µF ceramic capacitors A capacitor is a passive two-terminal electrical component used to store electrical energy temporarily in an electric field.; PROD_ID: CAP-12417
C15 C16 = OPL_Capacitor:CERAMIC-10UF-6.3V-20%-X5R(0402): 302010053; MPN: CC0402MRX5R5BB106; VALUE: 10uf
C17 C18 = OPL_Capacitor:CERAMIC-4.7UF-6.3V-20%-X5R(0402): 302010019; MPN: CC0402MRX5R5BB475; VALUE: 4.7uf
C19 C24 C26 C28 = OPL_Capacitor:CERAMIC-390PF-50V-10%-X7R(0402): 302010260; MPN: CC0402KRX7R9BB391; VALUE: 390PF 50V
C20 C21 = OPL_Capacitor:CERAMIC-33PF-50V-5%-NPO(0402): 302010000; MPN: CC0402JRNPO9BN330
C30-C41 = OPL_Capacitor:CERAMIC-100NF-25V-10%-X7R(0402): 302010024; MPN: CC0402KRX7R8BB104
C42 = OPL_Capacitor:TANTALUM-SMD-22UF-10V(AVX-A): 302020008; MPN: TAJA226*010#NJ; VALUE: 22uf
D1 D2 = OPL_Optoelectronics:SMD-LED-CLEAR-BLUE(0402): 304090075; MPN: BL-HB337A-AV-TRB
D3 = OPL_Discrete_Semiconductor:SMD-DIODE-SCHOTTKY-20V-1A(SOD-123): 304020034; MPN: B5819W
D4 = OPL_Optoelectronics:SMD-LED-CLEAR-BLUE(0402): 304090075; MPN: BL-HB337A-AV-TRB; VALUE: BLUE-0402
FD1-FD6 = SparkFun-Aesthetics:FIDUCIAL: Fiducial Alignment Points Point-of-reference for pick-and-place machines and other optical instruments.
H1-H8 = M25:M25
IC1 = SamacSys_Parts:IS25LP256D-JLLE-TR: NOR Flash 256M 3V 166MHZ Serial Flash Source: Datasheet <http://www.issi.com/WW/pdf/25LP-WP256D_128D.pdf>; ARROW_PART_NUMBER: IS25LP256D-JLLE-TR; ARROW_PRICE-STOCK: https://www.arrow.com/en/products/is25lp256d-jlle-tr/integrated-silicon-solution-inc; DESCRIPTION: NOR Flash 256M 3V 166MHZ Serial Flash; HEIGHT: 0.8mm; MANUFACTURER_NAME: Integrated Silicon Solution Inc.; MANUFACTURER_PART_NUMBER: IS25LP256D-JLLE-TR; MOUSER_PART_NUMBER: 870-IS25LP256DJLLETR; MOUSER_PRICE-STOCK: https://www.mouser.co.uk/ProductDetail/ISSI/IS25LP256D-JLLE-TR?qs=o7k0yqUNuKDsOqgNsf15cQ%3D%3D
IC2 = SamacSys_Parts:IS31FL3737-QFLS4-TR: IC LED DRVR LINEAR 45MA 40QFN Source: Datasheet <https://datasheet.datasheetarchive.com/originals/distributors/Datasheets_SAMA/e05c949fa8cd11ee68cb1878b30af28a.pdf>; DESCRIPTION: IC LED DRVR LINEAR 45MA 40QFN; HEIGHT: 0.8mm; MANUFACTURER_NAME: Lumissil; MANUFACTURER_PART_NUMBER: IS31FL3737-QFLS4-TR; MOUSER_PART_NUMBER: 870-31FL3737QFLS4TR; MOUSER_PRICE-STOCK: https://www.mouser.co.uk/ProductDetail/Lumissil/IS31FL3737-QFLS4-TR/?qs=o7k0yqUNuKAJ%252B%252BDONCPK0Q%3D%3D
J1 = TYPE-C-31-M-12:TYPE-C-31-M-12: Check availability <https://pricing.snapeda.com/parts/TYPE-C-31-M-12/HRO%20Electronics%20Co.%2C%20Ltd./view-part?ref=eda>; AVAILABILITY: Not in stock; DESCRIPTION: USB Connectors 24 Receptacle 1 8.94*7.3mm RoHS; MF: HRO Electronics Co., Ltd.; MP: TYPE-C-31-M-12; PACKAGE: Package; PRICE: None
J2 = SparkFun-Connectors:JST_2MM_MALE: JST 2MM MALE RA CONNECTOR Two pin, compact surface mount connector. Commonly used as a battery input connection point. We really like the solid locking feeling and high current rating on these small connectors. We use these all the time as battery connectors. Mates to single-cell LiPo batteries. Here is the connector we sell at SparkFun: JST Right Angle Connector - White <https://www.sparkfun.com/products/8612> (PRT-08612) Datasheet <http://www.sparkfun.com/datasheets/Prototyping/Connectors/JST-Horizontal.pdf> It was used on these SparkFun products: SparkFun MOSFET Power Controller <https://www.sparkfun.com/products/11214> (PRT-11214) SparkFun Battery Babysitter - LiPo Battery Manager <https://www.sparkfun.com/products/13777> (PRT-13777) And many, many others that required a lipo battery connection.; PROD_ID: CONN-11443; SF_ID: PRT-08612
JP1 = SparkFun-Jumpers:JUMPER-SMT_2_NO: Normally open jumper This jumper has two pads in close proximity to each other. Apply solder to close the connection. Round pads are easier to solder for beginners, but are a lot larger. SparkFun Product that uses the round pads: SparkFun EL Sequencer <https://www.sparkfun.com/products/12781>
L2 = SparkFun-Coils:INDUCTOR: Inductors Resist changes in electrical current. Basically a coil of wire. SparkFun Products: SparkFun Load Cell Amplifier - HX711 <https://www.sparkfun.com/products/13879> IOIO-OTG - V2.2 <https://www.sparkfun.com/products/13613>; PROD_ID: NDUC-13457; VALUE: 3.9NH
LED1-LED12 = WS2812B-2020:WS2812B-2020: A small 2x2mm addressable RGB led Check availability <https://pricing.snapeda.com/parts/WS2812B-2020/WorldSemi/view-part?ref=eda>; AVAILABILITY: Not in stock; DESCRIPTION: Programmable LED; SMD; 2020; RGB; 2x2x0.84mm; 3.7÷5.3V; 2kHz; MF: WorldSemi; MP: WS2812B-2020; PACKAGE: None; PRICE: None
MK1 = ICS-41350:ICS-41350: Bottom Port PDM Low Power muti-Mode Microphone with high AOP Mode Check availability <https://pricing.snapeda.com/parts/ICS-41350/TDK%20InvenSense/view-part?ref=eda>; AVAILABILITY: In Stock; DESCRIPTION: 50 Hz ~ 40 kHz Digital, PDM Microphone MEMS (Silicon) 1.65 V ~ 3.63 V Omnidirectional (-32dB ±1dB) Solder Pads; MF: TDK InvenSense; MP: ICS-41350; PACKAGE: None; PRICE: None; PURCHASE-URL: https://pricing.snapeda.com/search/part/ICS-41350/?ref=eda
Q1 = adafruit:XTAL-4: Classic 4-pin 3.2 x 2.5mm crystal
Q2 = SparkFun-DiscreteSemi:MOSFET_PCH: P-channel MOSFETs Voltage controlled devices that allow control of high current outputs. SparkFun Products: SparkFun ESP32 Thing <https://www.sparkfun.com/products/13907> SparkFun ESP8266 Thing <https://www.sparkfun.com/products/13231>; PROD_ID: TRANS-11308
R1-R15 R19 = SparkFun-Resistors:RESISTOR: Generic Resistor Package
R16-R18 = SparkFun-Resistors:100KOHM: 100kΩ resistor A resistor is a passive two-terminal electrical component that implements electrical resistance as a circuit element. Resistors act to reduce current flow, and, at the same time, act to lower voltage levels within circuits. - Wikipedia; PROD_ID: RES-13495
RGB1-RGB48 = 19-337C_RSBHGHC-A88_4T:19-337C/RSBHGHC-A88/4T: Red, Green, Blue (RGB) 625nm Red, 530nm Green, 470nm Blue LED Indication - Discrete 2.05V Red, 2.9V Green, 2.9V Blue 0606 (1616 Metric) Check availability <https://pricing.snapeda.com/parts/19-337C/RSBHGHC-A88/4T/Everlight%20Electronics%20Co%20Ltd/view-part?ref=eda>; AVAILABILITY: In Stock; DESCRIPTION: Red, Green, Blue (RGB) 625nm Red, 530nm Green, 470nm Blue LED Indication - Discrete 2.05V Red, 2.9V Green, 2.9V Blue 0606 (1616 Metric); MF: Everlight Electronics Co Ltd; MP: 19-337C/RSBHGHC-A88/4T; PACKAGE: 0606 Everlight Electronics Co Ltd; PRICE: None; PURCHASE-URL: https://pricing.snapeda.com/search/part/19-337C/RSBHGHC-A88/4T/?ref=eda
S1-S3 = SparkFun-Switches:MOMENTARY-SWITCH-SPST: Momentary Switch (Pushbutton) - SPST Normally-open (NO) SPST momentary switches (buttons, pushbuttons). Variants PTH-12MM - 12mm square, through-hole Momentary Pushbutton Switch - 12mm Square <https://www.sparkfun.com/products/9190> (COM-09190) PTH-6.0MM, PTH-6.0MM-KIT - 6.0mm square, through-hole Mini Pushbutton Switch <https://www.sparkfun.com/products/97> (COM-00097) KIT package intended for soldering kit's - only one side of pads' copper is exposed. PTH-RIGHT-ANGLE-KIT - Right-angle, through-hole Right Angle Tactile Button <https://www.sparkfun.com/products/10791> - Used on SparkFun BigTime Watch Kit <https://www.sparkfun.com/products/11734> SMD-12MM - 12mm square, surface-mount Tactile Button - SMD (12mm) <https://www.sparkfun.com/products/12993> (COM-12993) Used on SparkFun PicoBoard <https://www.sparkfun.com/products/11888> SMD-4.5MM - 4.5mm Square Trackball Switch Used on SparkFun Blackberry Trackballer Breakout <https://www.sparkfun.com/products/13169> SMD-4.6MMX2.8MM - 4.60mm x 2.80mm, surface mount Used on SparkFun SAMD21 Mini Breakout <https://www.sparkfun.com/products/13664> SMD-5.2MM, SMD-5.2-REDUNDANT - 5.2mm square, surface-mount Mini Pushbutton Switch - SMD <https://www.sparkfun.com/products/8720> (COM-08720) Used on Arduino Pro Mini <https://www.sparkfun.com/products/11114> REDUNDANT package connects both switch circuits together SMD-6.0X3.5MM - 6.0 x 3.5mm, surface mount Momentary Reset Switch SMD <https://www.sparkfun.com/products/8229> (COM-08229) SMD-6.2MM-TALL - 6.2mm square, surface mount Tactile Button - SMD (6mm) <https://www.sparkfun.com/products/12992> Used on SparkFun Digital Sandbox <https://www.sparkfun.com/products/12651> SMD-RIGHT-ANGLE - Right-angle, surface mount Used on SparkFun Block for Intel® Edison - Arduino <https://www.sparkfun.com/products/13036>; PROD_ID: SWCH-13065
SW1 = PCM12SMTR:PCM12SMTR: Switch Slide ON ON SPDT Side Slide 0.3A 6VDC 10000Cycles Gull Wing SMD T/R Check availability <https://pricing.snapeda.com/parts/PCM12SMTR/C%26K/view-part?ref=eda>; AVAILABILITY: In Stock; DESCRIPTION: Slide Switch SPDT Surface Mount, Right Angle; MF: C&K; MP: PCM12SMTR; PACKAGE: None; PRICE: None; PURCHASE-URL: https://pricing.snapeda.com/search/part/PCM12SMTR/?ref=eda
U1 = RP2040:RP2040: Check availability <https://pricing.snapeda.com/parts/RP2040/Raspberry%20Pi/view-part?ref=eda>; AVAILABILITY: In Stock; DESCRIPTION: RP2040 chip for Raspberry Pi Pico - ARM® Cortex®-M0+ MCU 32-Bit; MF: Raspberry Pi; MP: RP2040; PACKAGE: None; PRICE: None; PURCHASE-URL: https://pricing.snapeda.com/search/part/RP2040/?ref=eda
U2 = BMI270:BMI270: IMU ACCEL/GYRO I2C/SPI 14LGA Check availability <https://pricing.snapeda.com/parts/BMI270/Bosch%20Sensortec/view-part?ref=eda>; AVAILABILITY: In Stock; DESCRIPTION: Accelerometer, Gyroscope, 6 Axis Sensor I²C, SPI Output; MF: Bosch Sensortec; MP: BMI270; PACKAGE: LGA-14 Bosch Sensortec; PRICE: None; PURCHASE-URL: https://pricing.snapeda.com/search/part/BMI270/?ref=eda
U3 = MIC5504-3.3YM5_TR:MIC5504-3.3YM5_TR: Linear Voltage Regulator IC 1 Output 300mA SOT-23-5 Check availability <https://pricing.snapeda.com/parts/MIC5504-3.3YM5%20TR/Microchip/view-part?ref=eda>; AVAILABILITY: In Stock; DESCRIPTION: Linear Voltage Regulator IC Positive Fixed 1 Output 300mA SOT-23-5; MF: Microchip; MP: MIC5504-3.3YM5 TR; PACKAGE: SOT-23 Microchip; PRICE: None; PURCHASE-URL: https://pricing.snapeda.com/search/part/MIC5504-3.3YM5 TR/?ref=eda
U4 = MCP73831T-2ATI_OT:MCP73831T-2ATI/OT: Check availability <https://pricing.snapeda.com/parts/MCP73831T-2ATI/OT/Microchip/view-part?ref=eda>; AVAILABILITY: In Stock; DESCRIPTION: Charger IC Lithium Ion/Polymer SOT-23-5; MF: Microchip; MP: MCP73831T-2ATI/OT; PACKAGE: SOT-23 Microchip; PRICE: None; PURCHASE-URL: https://pricing.snapeda.com/search/part/MCP73831T-2ATI/OT/?ref=eda